# Altium schematic sheet 08_DC_DC.SchDoc
size A4; PageSetup: Record=PageOptions|CenterHorizontal=True|CenterVertical=True|PrintScale=0.97|XCorrection=1.00|YCorrection=1.00|PrintKind=0|BorderSize=5000000|LeftOffset=0|BottomOffset=0|Orientation=2|PaperLength=1000|PaperWidth=1000|Scale=100|PaperSource=7|PrintQuality=-4|MediaType=1|DitherType=10|PaperKind=A4|PrintScaleMode=1
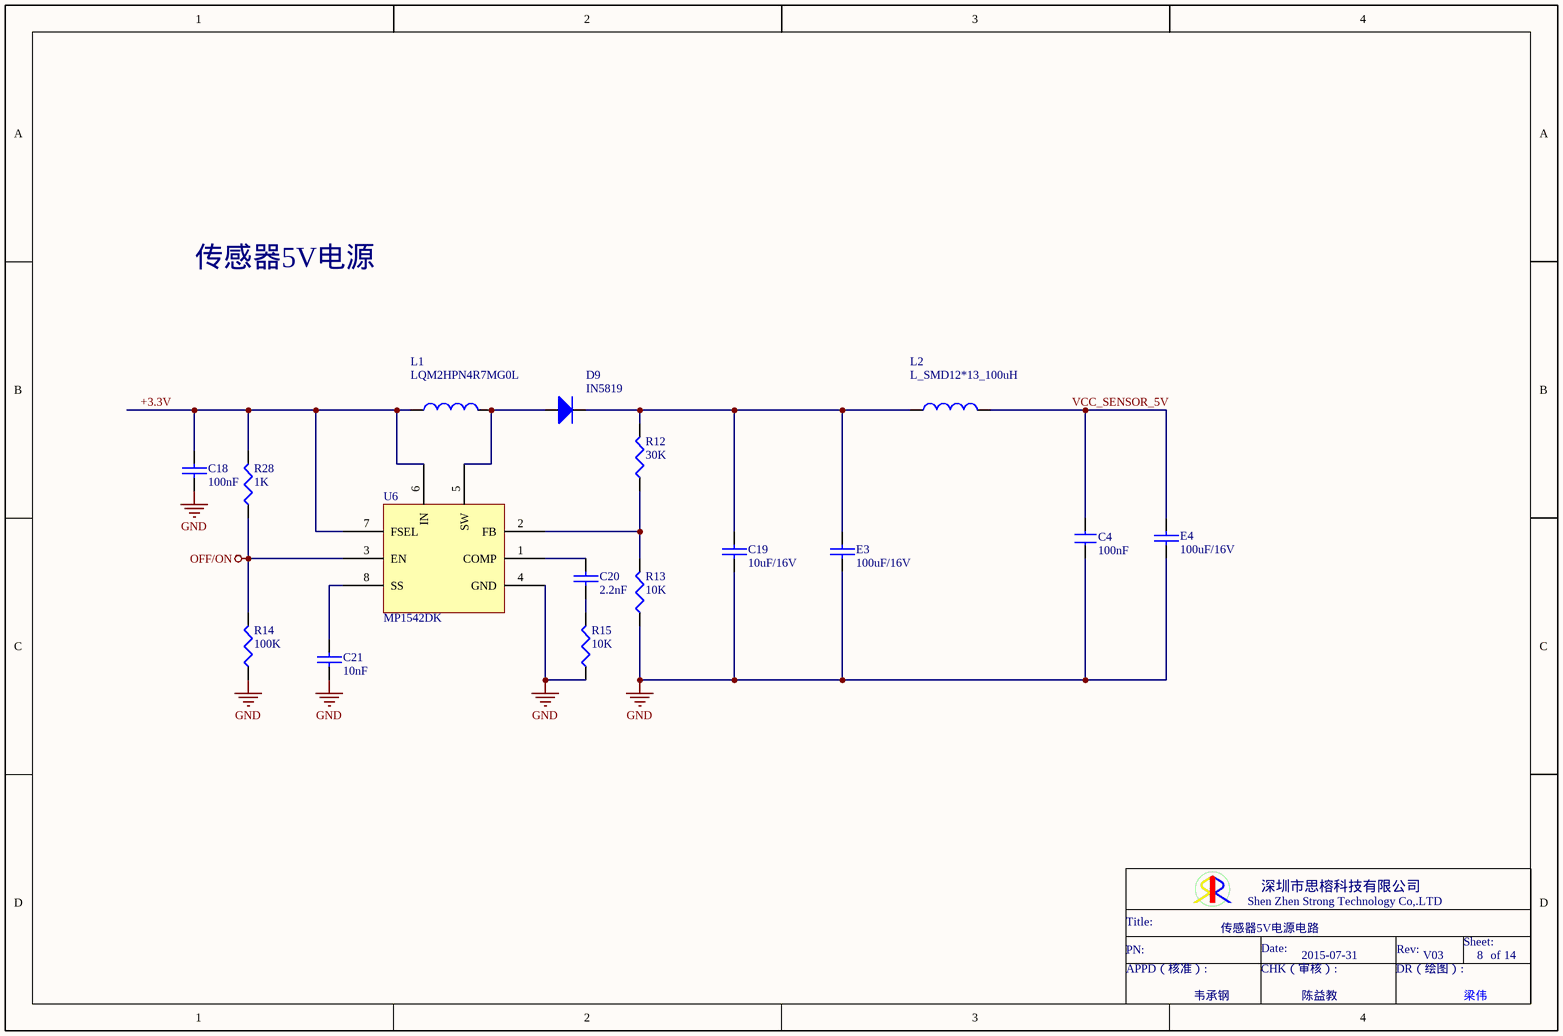
[diagram p0: 08_DC_DC.SchDoc]

## Parts
C4  100nF  [0603C]
C18  100nF  [0603C]
C19  10uF/16V  [A]
C20  2.2nF  [0603C]
C21  10nF  [0603C]
D9  IN5819  [1206D]
E3  100uF/16V  [6032]
E4  100uF/16V  [6032]
L1  LQM2HPN4R7MG0L  [3225]
L2  L_SMD12*13_100uH  [L-SMD12*13]
R12  30K  [0603R]
R13  10K  [0603R]
R14  100K  [0603R]
R15  10K  [0603R]
R28  1K  [0603R]
U6  MP1542DK  [SSOP8]

## Nets
GND: C4.2 C18.2 C19.2 C21.2 E3.2 E4.2 R13.1 R14.1 R15.1 U6.4(GND)
OFF/ON: R14.2 R28.1 U6.3(EN)
+3.3V: C18.1 L1.1 R28.2 U6.6(IN) U6.7(FSEL)
VCC_SENSOR_5V: C4.1 E4.1 L2.2
NetC19_1: C19.1 D9.2 E3.1 L2.1 R12.2
NetC20_1: C20.1 U6.1(COMP)
NetC20_2: C20.2 R15.2
NetC21_1: C21.1 U6.8(SS)
NetD9_1: D9.1 L1.2 U6.5(SW)
NetR12_1: R12.1 R13.2 U6.2(FB)

## Notes on the sheet
- 传感器5V电源
- 传感器5V电源电路
- 2015-07-31
- V03
- 8
- 14
- 韦承钢
- 陈益教
- Shen Zhen Strong Technology Co,.LTD
- 深圳市思榕科技有限公司
- Title:
- PN:
- APPD（核准）:
- Date:
- CHK（审核）:
- DR（绘图）:
- Rev:
- Sheet:
- of
- 梁伟

## Library data of the parts
C4 = 电容: Capacitor; Value: 100nF
C18-C21 E3 E4 = CAP: Capacitor
D9 = D: 二极管
L1 L2 = Inductor: Code_IEC: 1005; Value: 4.7uH; Published: 8-Jun-2000; LatestRevisionDate: 29-May-2009; LatestRevisionNote: IPC-7351 Footprint Added.; PackageReference: 0402-A; Publisher: Altium Limited; PackageDescription: Chip Inductor; Code_JEITA: 0402
R12-R15 R28 = RES1
U6 = MP1542DK: MPS公司产品   DC-DC控制IC; Published: 8-Jun-2000; LatestRevisionDate: 29-May-2009; LatestRevisionNote: IPC-7351 Footprint Added.; PackageVersion: Aug-1999; PackageReference: SOT-23B; Publisher: Altium Limited; PackageDescription: 3-Pin SOT-23 Package 0.95 mm Pitch, 2.4 mm Lead Span